# Altium schematic sheet MCU.SchDoc
size 431 x 279 mm; SheetNumber: 1; SheetTotal: 4
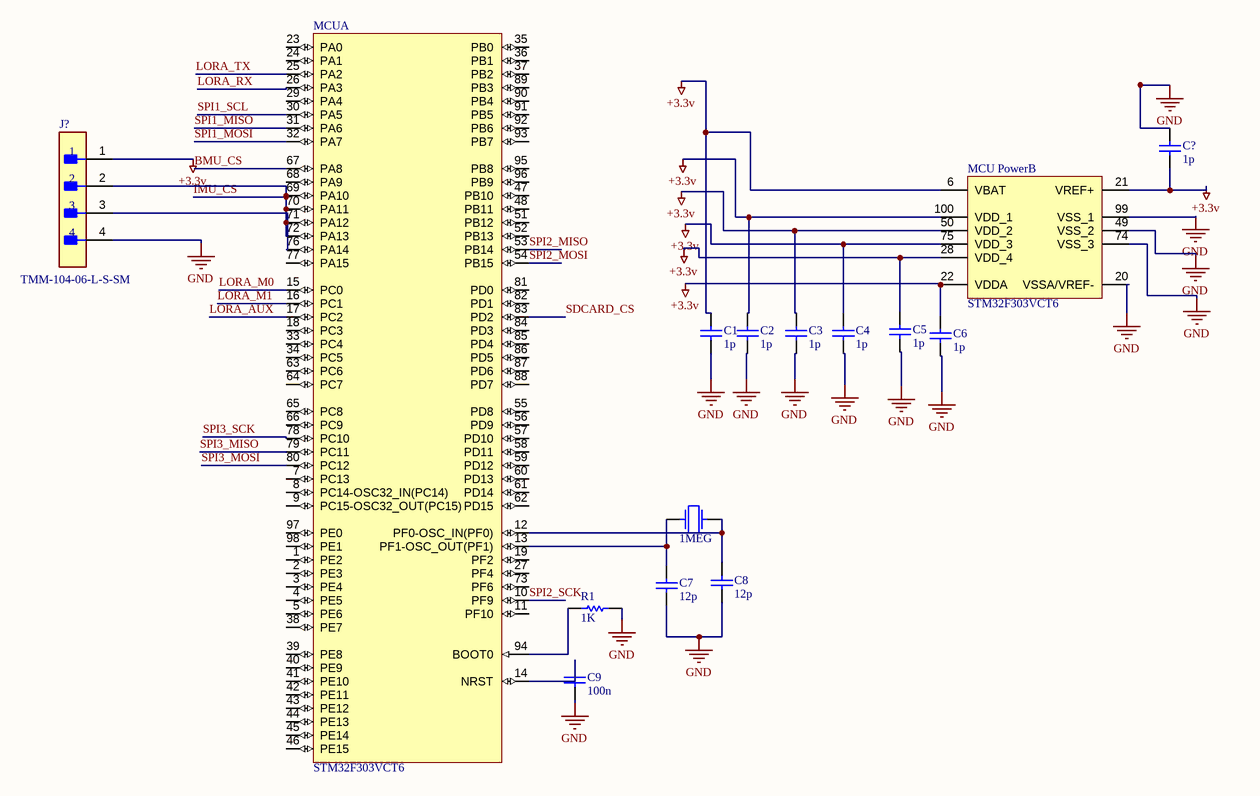
[diagram p0: MCU.SchDoc]

## Parts
?  F0: 1MEG  (hidden comment: Crystal)
C1  value 1p  (hidden comment: Capacitor)
C2  value 1p  (hidden comment: Capacitor)
C3  value 1p  (hidden comment: Capacitor)
C4  value 1p  (hidden comment: Capacitor)
C5  value 1p  (hidden comment: Capacitor)
C6  C6: 1p  (hidden comment: Capacitor)
C7  value 12p  (hidden comment: Capacitor)
C8  C8: 12p  (hidden comment: Capacitor)
C9  value 100n  (hidden comment: Capacitor)
C?  C6: 1p  (hidden comment: Capacitor)
J?  TMM-104-06-L-S-SM  [FP-TMM-104-06-L-S-SM-MFG]
MCU  STM32F303VCT6  [STM-LQFP100_L]  (part A of 2)
MCU_Power  STM32F303VCT6  [STM-LQFP100_L]  (part B of 2)
R1  value 1K  (hidden comment: Resistor)

## Nets
+3.3v: C1.2 C2.2 C3.2 C4.2 C5.2 C6.2 C?.1 J?.1 MCU_Power.6(VBAT) MCU_Power.21(VREF+) MCU_Power.22(VDDA) MCU_Power.28(VDD_4) MCU_Power.50(VDD_2) MCU_Power.75(VDD_3) MCU_Power.100(VDD_1)
GND: C1.1 C2.1 C3.1 C4.1 C5.1 C6.1 C7.1 C8.1 C9.1 C?.2 J?.4 MCU_Power.20(VSSA/VREF-) MCU_Power.49(VSS_2) MCU_Power.74(VSS_3) MCU_Power.99(VSS_1) R1.2
BMU_CS: MCU.67(PA8)
IMU_CS: J?.2 MCU.69(PA10) MCU.70(PA11) MCU.71(PA12) MCU.72(PA13)
LORA_AUX: MCU.17(PC2)
LORA_M0: MCU.15(PC0)
LORA_M1: MCU.16(PC1)
LORA_RX: MCU.26(PA3)
LORA_TX: MCU.25(PA2)
SDCARD_CS: MCU.83(PD2)
SPI1_MISO: MCU.31(PA6)
SPI1_MOSI: MCU.32(PA7)
SPI1_SCL: MCU.30(PA5)
SPI2_MISO: MCU.53(PB14)
SPI2_MOSI: MCU.54(PB15)
SPI2_SCK: MCU.10(PF9)
SPI3_MISO: MCU.79(PC11)
SPI3_MOSI: MCU.80(PC12)
SPI3_SCK: MCU.78(PC10)
Net?_1: ?.1 C7.2 MCU.13(PF1-OSC_OUT(PF1))
Net?_2: ?.2 C8.2 MCU.12(PF0-OSC_IN(PF0))
NetC9_2: C9.2 MCU.14(NRST)
NetJ?_3: J?.3 MCU.76(PA14)
NetMCU_94: MCU.94(BOOT0) R1.1

Not connected (* = marked no-connect by the designer): MCU 1(PE2) 2(PE3) 3(PE4) 4(PE5) 5(PE6) 7(PC13) 8(PC14-OSC32_IN(PC14)) 9(PC15-OSC32_OUT(PC15)) 11(PF10) 18(PC3) 19(PF2) 23(PA0) 24(PA1) 27(PF4) 29(PA4) 33(PC4) 34(PC5) 35(PB0) 36(PB1) 37(PB2) 38(PE7) 39(PE8) 40(PE9) 41(PE10) 42(PE11) 43(PE12) 44(PE13) 45(PE14) 46(PE15) 47(PB10) 48(PB11) 51(PB12) 52(PB13) 55(PD8) 56(PD9) 57(PD10) 58(PD11) 59(PD12) 60(PD13) 61(PD14) 62(PD15) 63(PC6) 64(PC7) 65(PC8) 66(PC9) 68(PA9) 73(PF6) 77(PA15) 81(PD0) 82(PD1) 84(PD3) 85(PD4) 86(PD5) 87(PD6) 88(PD7) 89(PB3) 90(PB4) 91(PB5) 92(PB6) 93(PB7) 95(PB8) 96(PB9) 97(PE0) 98(PE1)

## Notes on the sheet
- DWG. NO.
- REV.
- SHT.
- THIS DOCUMENT AND THE DATA DISCLOSED HEREIN OR HEREWITH IS THE PROPERTY OF ALTIUM LIMITED AND MAY BE FREELY DISTRIBUTED IN WHOLE. NO RIGHTS ARE RESERVED OR EXPRESS OR IMPLIED WARANTEE GIVEN.
- REVISION
- DESCRIPTION
- DATE
- APPROVED
- ENG:
- APPROVALS
- PROJECT
- DSN:
- CHK:
- REFERENCE DOCUMENTS
- PROJECT REVISION:
- TITLE
- DOCUMENT REVISION:
- DESIGN ITEM:
- BOM:
- FAB DWG:
- PCB DWG:
- ASSY DWG:
- SCALE:
- SIZE
- B
- CAGE CODE
- FILE NAME
- DWG NO.
- SHEET
- OF
- REV

## Library data of the parts
? = Crystal: R: 500; Q: 50K; SimulationGenericComponent: True
C1-C9 C? = Capacitor: SimulationGenericComponent: True
J? = CMP-02766-001580-1: 2MM TERMINAL STRIP; Connector Type: Header; Max Current Rating: 3.9A; Number of Positions: 4; Gender: Male; Max Voltage Rating (AC): 500V; Contact Type: Male Pin; Flammability Rating: UL94 V-0; Length: 8mm; Housing Material: Polymer; Contact Finish - Mating: GOLD; Fastening Type: Pull; Max Operating Temperature: 125°C; Contact Shape: Square; Number of Contacts: 4; Series: TMM; Pitch: 2mm; Orientation: Straight; RoHS Compliant: Yes; Lead Free: Lead Free; Contact Material: Bronze; Termination: Solder; Insulation Color: Black; Min Operating Temperature: -55°C; Insulation Material: Polymer; Housing Color: Black; Number of Rows: 1; Packaging: Rail/Tube; Depth: 1.97mm; Contact Plating: Gold; Radiation Hardening: No
MCU MCU_Power = CMP-0572-00009-2: ARM Cortex-M4 32-bit MCU, 256 KB Flash, 40 KB Internal RAM, 87 I/Os, 100-pin LQFP, -40 to 85 degC, Tray; Internal RAM Size (kB): 40; FLASH Size (Prog) (kB): 256; Supply Voltage(Vcc) min (V): 2; I/Os (High Current): 87; Operating Frequency(F) (Processor speed) (MHz): 72; D/A Converter: 2x12-bit (2 Channel); ComponentLink2URL: http://www.st.com/st-web-ui/static/active/en/resource/technical/document/datasheet/DM00058181.pdf; PackageVersion: Rev. 1, 06/2013; ComponentLink2Description: Datasheet; DatasheetVersion: Rev. 6; Packing: Tray; ComponentLink3Description: Package Specification; Mounting Technology: Surface Mount; PackageReference: LQFP100; ComponentLink1URL: http://www.st.com/web/en/home.html; ComponentLink3URL: http://www.st.com/st-web-ui/static/active/en/resource/technical/document/data_brief/DM00071938.pdf; PackageDescription: 100-Pin Low Profile Quad Flat Package, 14 x 14 mm Body, 0.5 mm Pitch; ComponentLink1Description: Manufacturer URL; PartNumber: STM32F303VCT6; Core: ARM Cortex-M4
R1 = Resistor: TC1: 0; SimulationGenericComponent: True; TC2: 0